# Altium schematic sheet DB30_Hardware_Kit.SchDoc: DB30 Hardware Kit
size A4; Address1: Level 3, 12a Rodborough Rd; Address2: Frenchs Forest 2086; Address3: NSW; Address4: AUSTRALIA; SheetNumber: 9; SheetTotal: 23
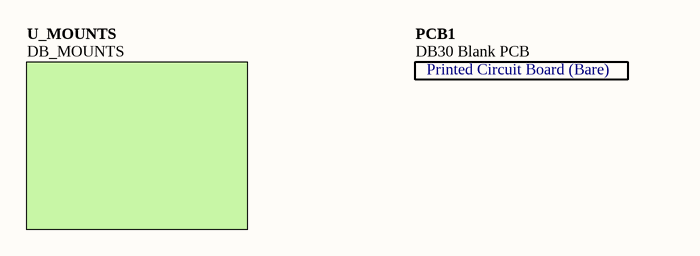
[diagram p0: DB30_Hardware_Kit.SchDoc]

## Parts
PCB1  DB30 Blank PCB  (mechanical)

## Sub-sheets
U_MOUNTS = DB_MOUNTS: no entries

## Notes on the sheet
- Sheet Title
- Project Title
- Size:
- Date:
- A4
- Assy:
- Time:
- Revision:
- Sheet
- of
- File:
- (in symbol D-810-0004) Printed Circuit Board (Bare)

## Library data of the parts
PCB1 = D-810-0004: DB30 Blank PCB - Daughter Board Xilinx Spartan3 XC3S1500-4FG676C; ProjectPath: DB30.PrjPCB; Status: Unreleased; Category: Blank PCB